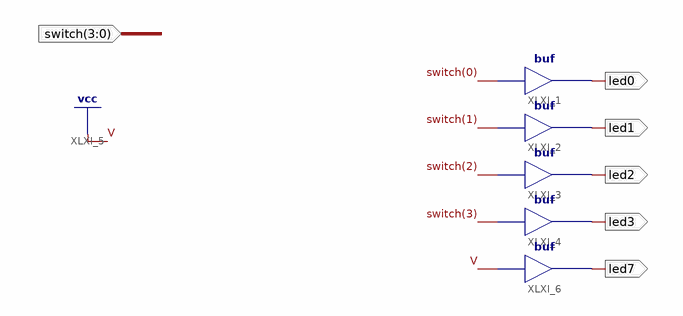
[diagram p0: schematic sheet 1]
// Xilinx ISE schematic Test1.sch (spartan3e) as structural Verilog: 5 symbols, 6 ports
module Test1 (
  input  [3:0] switch,
  output led0,
  output led1,
  output led2,
  output led3,
  output led7
);

  buf XLXI_1 (led0, switch[0]);
  buf XLXI_2 (led1, switch[1]);
  buf XLXI_3 (led2, switch[2]);
  buf XLXI_4 (led3, switch[3]);
  buf XLXI_6 (led7, 1'b1);
endmodule
